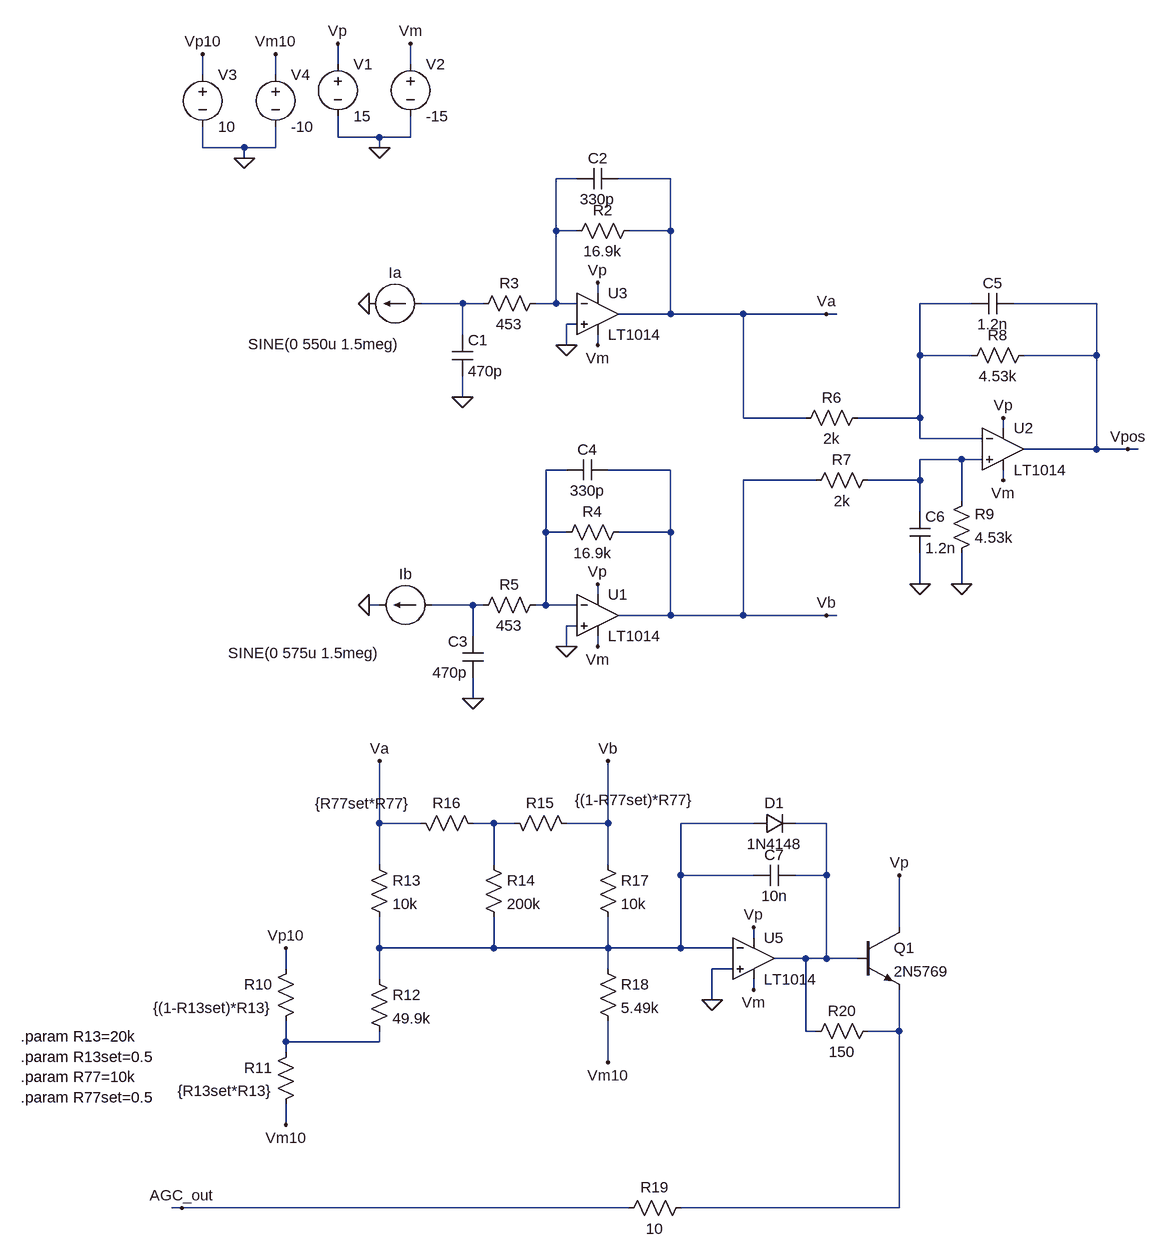
[diagram p0: schematic PositionDemodulator_CamTech.asc]
PositionDemodulator_CamTech.asc, the LTspice schematic file:
Version 4
SHEET 1 1272 1552
WIRE 0 -256 0 -288
WIRE 112 -256 112 -288
WIRE -208 -240 -208 -272
WIRE -96 -240 -96 -272
WIRE 0 -144 0 -176
WIRE 64 -144 0 -144
WIRE 112 -144 112 -176
WIRE 112 -144 64 -144
WIRE -208 -128 -208 -160
WIRE -144 -128 -208 -128
WIRE -96 -128 -96 -160
WIRE -96 -128 -144 -128
WIRE 64 -128 64 -144
WIRE -144 -112 -144 -128
WIRE 368 -80 336 -80
WIRE 512 -80 432 -80
WIRE 336 0 336 -80
WIRE 368 0 336 0
WIRE 512 0 512 -80
WIRE 512 0 448 0
WIRE 400 96 400 80
WIRE 192 112 128 112
WIRE 224 112 192 112
WIRE 336 112 336 0
WIRE 336 112 304 112
WIRE 368 112 336 112
WIRE 976 112 896 112
WIRE 1168 112 1040 112
WIRE 512 128 512 0
WIRE 512 128 432 128
WIRE 624 128 512 128
WIRE 752 128 624 128
WIRE 768 128 752 128
WIRE 368 144 352 144
WIRE 192 160 192 112
WIRE 352 176 352 144
WIRE 400 176 400 160
WIRE 896 192 896 112
WIRE 976 192 896 192
WIRE 1168 192 1168 112
WIRE 1168 192 1056 192
WIRE 192 256 192 224
WIRE 624 288 624 128
WIRE 720 288 624 288
WIRE 896 288 896 192
WIRE 896 288 800 288
WIRE 1024 304 1024 288
WIRE 896 320 896 288
WIRE 992 320 896 320
WIRE 1168 336 1168 192
WIRE 1168 336 1056 336
WIRE 1216 336 1168 336
WIRE 1232 336 1216 336
WIRE 960 352 896 352
WIRE 992 352 960 352
WIRE 352 368 320 368
WIRE 512 368 416 368
WIRE 736 384 624 384
WIRE 896 384 896 352
WIRE 896 384 816 384
WIRE 1024 384 1024 368
WIRE 960 416 960 352
WIRE 896 432 896 384
WIRE 320 464 320 368
WIRE 352 464 320 464
WIRE 512 464 512 368
WIRE 512 464 432 464
WIRE 896 544 896 496
WIRE 960 544 960 496
WIRE 400 560 400 544
WIRE 64 576 48 576
WIRE 208 576 144 576
WIRE 224 576 208 576
WIRE 320 576 320 464
WIRE 320 576 304 576
WIRE 368 576 320 576
WIRE 512 592 512 464
WIRE 512 592 432 592
WIRE 624 592 624 384
WIRE 624 592 512 592
WIRE 752 592 624 592
WIRE 768 592 752 592
WIRE 368 608 352 608
WIRE 208 624 208 576
WIRE 352 640 352 608
WIRE 400 640 400 624
WIRE 208 720 208 688
WIRE 64 912 64 816
WIRE 128 912 64 912
WIRE 240 912 208 912
WIRE 272 912 240 912
WIRE 416 912 416 816
WIRE 416 912 352 912
WIRE 640 912 528 912
WIRE 752 912 704 912
WIRE 64 976 64 912
WIRE 240 976 240 912
WIRE 416 976 416 912
WIRE 528 992 528 912
WIRE 640 992 528 992
WIRE 752 992 752 912
WIRE 752 992 704 992
WIRE 864 1072 864 992
WIRE 640 1088 640 1072
WIRE 64 1104 64 1056
WIRE 240 1104 240 1056
WIRE 240 1104 64 1104
WIRE 416 1104 416 1056
WIRE 416 1104 240 1104
WIRE 528 1104 528 992
WIRE 528 1104 416 1104
WIRE 608 1104 528 1104
WIRE 720 1120 672 1120
WIRE 752 1120 752 992
WIRE 752 1120 720 1120
WIRE 800 1120 752 1120
WIRE -80 1136 -80 1104
WIRE 416 1136 416 1104
WIRE 608 1136 576 1136
WIRE 64 1152 64 1104
WIRE 640 1168 640 1152
WIRE 576 1184 576 1136
WIRE 720 1232 720 1120
WIRE 736 1232 720 1232
WIRE 864 1232 864 1168
WIRE 864 1232 816 1232
WIRE -80 1248 -80 1216
WIRE 64 1248 64 1232
WIRE 64 1248 -80 1248
WIRE -80 1264 -80 1248
WIRE 416 1280 416 1216
WIRE -80 1376 -80 1344
WIRE -240 1504 -256 1504
WIRE 448 1504 -240 1504
WIRE 864 1504 864 1232
WIRE 864 1504 528 1504
FLAG 48 112 0
FLAG 192 256 0
FLAG 64 -128 0
FLAG 112 -288 Vm
FLAG 0 -288 Vp
FLAG 400 80 Vp
FLAG 400 176 Vm
FLAG 400 544 Vp
FLAG 400 640 Vm
FLAG 1024 288 Vp
FLAG 1024 384 Vm
FLAG 640 1072 Vp
FLAG 640 1168 Vm
FLAG 352 176 0
FLAG 352 640 0
FLAG 960 544 0
FLAG 896 544 0
FLAG 208 720 0
FLAG 48 576 0
FLAG 752 592 Vb
FLAG 752 128 Va
FLAG -144 -112 0
FLAG -96 -272 Vm10
FLAG -208 -272 Vp10
FLAG -80 1104 Vp10
FLAG -80 1376 Vm10
FLAG 416 1280 Vm10
FLAG 864 992 Vp
FLAG 576 1184 0
FLAG 64 816 Va
FLAG 416 816 Vb
FLAG -240 1504 AGC_out
FLAG 1216 336 Vpos
SYMBOL current 128 112 R90
WINDOW 0 -32 40 VBottom 2
WINDOW 3 47 149 VTop 2
WINDOW 123 0 0 Left 2
WINDOW 39 0 0 Left 2
SYMATTR InstName Ia
SYMATTR Value SINE(0 550u 1.5meg)
SYMBOL current 144 576 R90
WINDOW 0 -32 40 VBottom 2
WINDOW 3 58 196 VTop 2
WINDOW 123 0 0 Left 2
WINDOW 39 0 0 Left 2
SYMATTR InstName Ib
SYMATTR Value SINE(0 575u 1.5meg)
SYMBOL cap 176 160 R0
SYMATTR InstName C1
SYMATTR Value 470p
SYMBOL res 464 -16 R90
WINDOW 0 0 56 VBottom 2
WINDOW 3 32 56 VTop 2
SYMATTR InstName R2
SYMATTR Value 16.9k
SYMBOL res 320 96 R90
WINDOW 0 0 56 VBottom 2
WINDOW 3 32 56 VTop 2
SYMATTR InstName R3
SYMATTR Value 453
SYMBOL res 448 448 R90
WINDOW 0 0 56 VBottom 2
WINDOW 3 32 56 VTop 2
SYMATTR InstName R4
SYMATTR Value 16.9k
SYMBOL res 320 560 R90
WINDOW 0 0 56 VBottom 2
WINDOW 3 32 56 VTop 2
SYMATTR InstName R5
SYMATTR Value 453
SYMBOL res 816 272 R90
WINDOW 0 0 56 VBottom 2
WINDOW 3 32 56 VTop 2
SYMATTR InstName R6
SYMATTR Value 2k
SYMBOL res 832 368 R90
WINDOW 0 0 56 VBottom 2
WINDOW 3 32 56 VTop 2
SYMATTR InstName R7
SYMATTR Value 2k
SYMBOL res 1072 176 R90
WINDOW 0 0 56 VBottom 2
WINDOW 3 32 56 VTop 2
SYMATTR InstName R8
SYMATTR Value 4.53k
SYMBOL res 944 512 M180
WINDOW 0 36 76 Left 2
WINDOW 3 36 40 Left 2
SYMATTR InstName R9
SYMATTR Value 4.53k
SYMBOL cap 432 -96 R90
WINDOW 0 0 32 VBottom 2
WINDOW 3 32 32 VTop 2
SYMATTR InstName C2
SYMATTR Value 330p
SYMBOL cap 224 688 R180
WINDOW 0 24 56 Left 2
WINDOW 3 24 8 Left 2
SYMATTR InstName C3
SYMATTR Value 470p
SYMBOL cap 352 384 R270
WINDOW 0 32 32 VTop 2
WINDOW 3 0 32 VBottom 2
SYMATTR InstName C4
SYMATTR Value 330p
SYMBOL cap 976 128 R270
WINDOW 0 32 32 VTop 2
WINDOW 3 0 32 VBottom 2
SYMATTR InstName C5
SYMATTR Value 1.2n
SYMBOL cap 880 432 R0
SYMATTR InstName C6
SYMATTR Value 1.2n
SYMBOL cap 704 976 R90
WINDOW 0 0 32 VBottom 2
WINDOW 3 32 32 VTop 2
SYMATTR InstName C7
SYMATTR Value 10n
SYMBOL Opamps\\LT1014 400 64 R0
SYMATTR InstName U3
SYMBOL voltage 0 -272 R0
WINDOW 123 0 0 Left 2
WINDOW 39 0 0 Left 2
SYMATTR InstName V1
SYMATTR Value 15
SYMBOL voltage 112 -272 R0
WINDOW 123 0 0 Left 2
WINDOW 39 0 0 Left 2
SYMATTR InstName V2
SYMATTR Value -15
SYMBOL Opamps\\LT1014 400 528 R0
SYMATTR InstName U1
SYMBOL Opamps\\LT1014 1024 272 R0
SYMATTR InstName U2
SYMBOL Opamps\\LT1014 640 1056 R0
SYMATTR InstName U5
SYMBOL res -64 1120 M0
SYMATTR InstName R10
SYMATTR Value {(1-R13set)*R13}
SYMBOL res -64 1248 M0
SYMATTR InstName R11
SYMATTR Value {R13set*R13}
SYMBOL res 48 1136 R0
SYMATTR InstName R12
SYMATTR Value 49.9k
SYMBOL res 48 960 R0
SYMATTR InstName R13
SYMATTR Value 10k
SYMBOL res 224 960 R0
SYMATTR InstName R14
SYMATTR Value 200k
SYMBOL res 368 928 M270
WINDOW 0 32 56 VTop 2
WINDOW 3 68 -89 VBottom 2
SYMATTR InstName R15
SYMATTR Value {(1-R77set)*R77}
SYMBOL res 224 928 M270
WINDOW 0 32 56 VTop 2
WINDOW 3 62 186 VBottom 2
SYMATTR InstName R16
SYMATTR Value {R77set*R77}
SYMBOL res 400 960 R0
SYMATTR InstName R17
SYMATTR Value 10k
SYMBOL res 400 1120 R0
SYMATTR InstName R18
SYMATTR Value 5.49k
SYMBOL diode 640 928 R270
WINDOW 0 32 32 VTop 2
WINDOW 3 0 32 VBottom 2
SYMATTR InstName D1
SYMATTR Value 1N4148
SYMBOL npn 800 1072 R0
SYMATTR InstName Q1
SYMATTR Value 2N5769
SYMBOL res 544 1488 R90
WINDOW 0 0 56 VBottom 2
WINDOW 3 32 56 VTop 2
SYMATTR InstName R19
SYMATTR Value 10
SYMBOL voltage -208 -256 R0
WINDOW 123 0 0 Left 2
WINDOW 39 0 0 Left 2
SYMATTR InstName V3
SYMATTR Value 10
SYMBOL voltage -96 -256 R0
WINDOW 123 0 0 Left 2
WINDOW 39 0 0 Left 2
SYMATTR InstName V4
SYMATTR Value -10
SYMBOL res 832 1216 R90
WINDOW 0 0 56 VBottom 2
WINDOW 3 32 56 VTop 2
SYMATTR InstName R20
SYMATTR Value 150
TEXT -488 1240 Left 2 !.param R13=20k\n.param R13set=0.5\n.param R77=10k\n.param R77set=0.5

The netlist it stands for:
* PositionDemodulator_CamTech.asc
Ia N002 0 SINE(0 550u 1.5meg)
Ib N006 0 SINE(0 575u 1.5meg)
C1 N002 0 470p
R2 Va N001 16.9k
R3 N001 N002 453
R4 Vb N005 16.9k
R5 N005 N006 453
R6 N003 Va 2k
R7 N004 Vb 2k
R8 Vpos N003 4.53k
R9 0 N004 4.53k
C2 Va N001 330p
C3 0 N006 470p
C4 N005 Vb 330p
C5 N003 Vpos 1.2n
C6 N004 0 1.2n
C7 N009 N008 10n
XU3 0 N001 Vp Vm Va LT1014  ; pins In+ In- V+ V- OUT
V1 Vp 0 15
V2 Vm 0 -15
XU1 0 N005 Vp Vm Vb LT1014  ; pins In+ In- V+ V- OUT
XU2 N004 N003 Vp Vm Vpos LT1014  ; pins In+ In- V+ V- OUT
XU5 0 N008 Vp Vm N009 LT1014  ; pins In+ In- V+ V- OUT
R10 Vp10 N011 {(1-R13set)*R13}
R11 N011 Vm10 {R13set*R13}
R12 N008 N011 49.9k
R13 Va N008 10k
R14 N007 N008 200k
R15 Vb N007 {(1-R77set)*R77}
R16 N007 Va {R77set*R77}
R17 Vb N008 10k
R18 N008 Vm10 5.49k
D1 N008 N009 1N4148
Q1 Vp N009 N010 0 2N5769
R19 N010 AGC_out 10
V3 Vp10 0 10
V4 Vm10 0 -10
R20 N010 N009 150
.model D D
.lib standard.dio
.model NPN NPN
.model PNP PNP
.lib standard.bjt
.param R13=20k
.param R13set=0.5
.param R77=10k
.param R77set=0.5
.backanno
.end